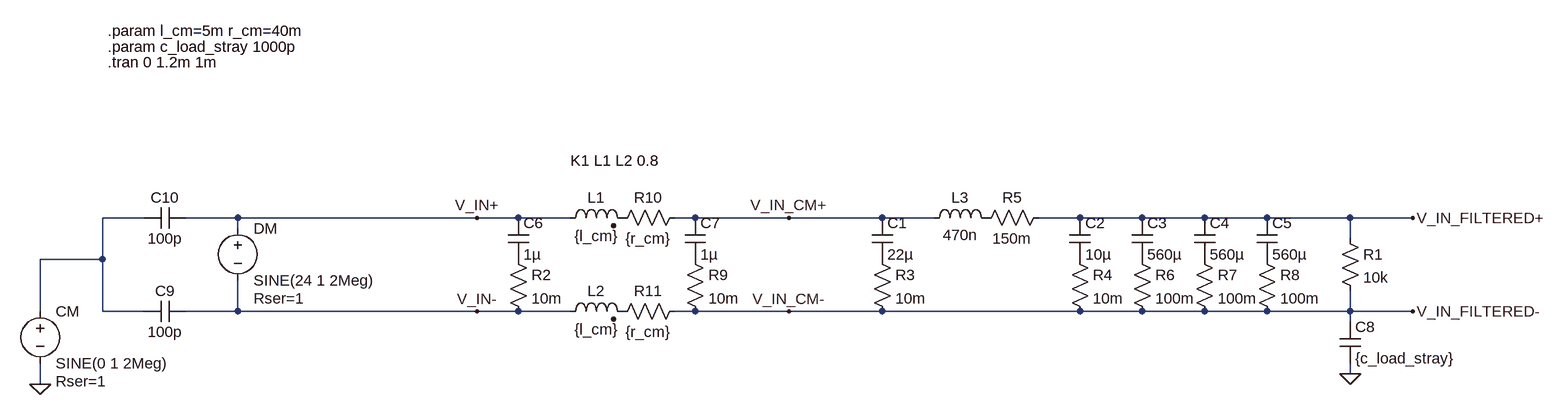
[diagram p0: schematic EMI_FILTER.asc]
EMI_FILTER.asc, the LTspice schematic file:
Version 4.1
SHEET 1 2384 752
WIRE -16 128 -80 128
WIRE 128 128 48 128
WIRE 496 128 128 128
WIRE 560 128 496 128
WIRE 640 128 560 128
WIRE 832 128 800 128
WIRE 976 128 832 128
WIRE 1120 128 976 128
WIRE 1200 128 1120 128
WIRE 1424 128 1360 128
WIRE 1520 128 1424 128
WIRE 1616 128 1520 128
WIRE 1712 128 1616 128
WIRE 1840 128 1712 128
WIRE 1936 128 1840 128
WIRE 128 144 128 128
WIRE 1840 160 1840 128
WIRE -80 192 -80 128
WIRE -80 192 -176 192
WIRE -176 272 -176 192
WIRE -80 272 -80 192
WIRE -16 272 -80 272
WIRE 128 272 128 224
WIRE 128 272 48 272
WIRE 496 272 128 272
WIRE 560 272 496 272
WIRE 640 272 560 272
WIRE 832 272 800 272
WIRE 976 272 832 272
WIRE 1120 272 976 272
WIRE 1424 272 1120 272
WIRE 1520 272 1424 272
WIRE 1616 272 1520 272
WIRE 1712 272 1616 272
WIRE 1840 272 1840 240
WIRE 1840 272 1712 272
WIRE 1936 272 1840 272
WIRE 1840 288 1840 272
WIRE 1840 368 1840 352
WIRE -176 384 -176 352
FLAG 976 128 V_IN_CM+
FLAG 976 272 V_IN_CM-
FLAG 1840 368 0
FLAG -176 384 0
FLAG 1936 128 V_IN_FILTERED+
FLAG 1936 272 V_IN_FILTERED-
FLAG 496 128 V_IN+
FLAG 496 272 V_IN-
SYMBOL cap 1104 128 R0
SYMATTR InstName C1
SYMATTR Value 22µ
SYMBOL ind 1184 144 R270
WINDOW 0 32 56 VTop 2
WINDOW 3 5 56 VBottom 2
SYMATTR InstName L3
SYMATTR Value 470n
SYMBOL cap 1408 128 R0
SYMATTR InstName C2
SYMATTR Value 10µ
SYMBOL res 1104 176 R0
SYMATTR InstName R3
SYMATTR Value 10m
SYMBOL res 1408 176 R0
SYMATTR InstName R4
SYMATTR Value 10m
SYMBOL res 1376 112 R90
WINDOW 0 0 56 VBottom 2
WINDOW 3 32 56 VTop 2
SYMATTR InstName R5
SYMATTR Value 150m
SYMBOL cap 1504 128 R0
SYMATTR InstName C3
SYMATTR Value 560µ
SYMBOL res 1504 176 R0
SYMATTR InstName R6
SYMATTR Value 100m
SYMBOL cap 1600 128 R0
SYMATTR InstName C4
SYMATTR Value 560µ
SYMBOL res 1600 176 R0
SYMATTR InstName R7
SYMATTR Value 100m
SYMBOL cap 1696 128 R0
SYMATTR InstName C5
SYMATTR Value 560µ
SYMBOL res 1696 176 R0
SYMATTR InstName R8
SYMATTR Value 100m
SYMBOL res 1824 144 R0
SYMATTR InstName R1
SYMATTR Value 10k
SYMBOL cap 544 128 R0
SYMATTR InstName C6
SYMATTR Value 1µ
SYMBOL res 544 176 R0
SYMATTR InstName R2
SYMATTR Value 10m
SYMBOL cap 816 128 R0
SYMATTR InstName C7
SYMATTR Value 1µ
SYMBOL res 816 176 R0
SYMATTR InstName R9
SYMATTR Value 10m
SYMBOL ind2 624 144 R270
WINDOW 0 32 56 VTop 2
WINDOW 3 4 56 VBottom 2
SYMATTR InstName L1
SYMATTR Value {l_cm}
SYMBOL res 816 112 R90
WINDOW 0 0 56 VBottom 2
WINDOW 3 32 56 VTop 2
SYMATTR InstName R10
SYMATTR Value {r_cm}
SYMBOL ind2 624 288 R270
WINDOW 0 32 56 VTop 2
WINDOW 3 4 56 VBottom 2
SYMATTR InstName L2
SYMATTR Value {l_cm}
SYMBOL res 816 256 R90
WINDOW 0 0 56 VBottom 2
WINDOW 3 32 56 VTop 2
SYMATTR InstName R11
SYMATTR Value {r_cm}
SYMBOL cap 1824 288 R0
SYMATTR InstName C8
SYMATTR Value {c_load_stray}
SYMBOL voltage 128 128 R0
WINDOW 123 0 0 Left 0
WINDOW 39 24 124 Left 2
SYMATTR SpiceLine Rser=1
SYMATTR InstName DM
SYMATTR Value SINE(24 1 2Meg)
SYMBOL cap 48 256 R90
WINDOW 0 0 32 VBottom 2
WINDOW 3 32 32 VTop 2
SYMATTR InstName C9
SYMATTR Value 100p
SYMBOL cap 48 112 R90
WINDOW 0 0 32 VBottom 2
WINDOW 3 32 32 VTop 2
SYMATTR InstName C10
SYMATTR Value 100p
SYMBOL voltage -176 256 R0
WINDOW 123 0 0 Left 0
WINDOW 39 24 124 Left 2
SYMATTR SpiceLine Rser=1
SYMATTR InstName CM
SYMATTR Value SINE(0 1 2Meg)
TEXT 640 40 Left 2 !K1 L1 L2 0.8
TEXT -72 -136 Left 2 !.param c_load_stray 1000p
TEXT -72 -112 Left 2 !.tran 0 1.2m 1m
TEXT -72 -160 Left 2 !.param l_cm=5m r_cm=40m

The netlist it stands for:
* EMI_FILTER.asc
C1 V_IN_CM+ P001 22µ
L3 V_IN_CM+ P002 470n
C2 V_IN_FILTERED+ P003 10µ
R3 P001 V_IN_FILTERED- 10m
R4 P003 V_IN_FILTERED- 10m
R5 V_IN_FILTERED+ P002 150m
C3 V_IN_FILTERED+ P004 560µ
R6 P004 V_IN_FILTERED- 100m
C4 V_IN_FILTERED+ P005 560µ
R7 P005 V_IN_FILTERED- 100m
C5 V_IN_FILTERED+ P006 560µ
R8 P006 V_IN_FILTERED- 100m
R1 V_IN_FILTERED+ V_IN_FILTERED- 10k
C6 V_IN+ P007 1µ
R2 P007 V_IN- 10m
C7 V_IN_CM+ P008 1µ
R9 P008 V_IN_FILTERED- 10m
L1 V_IN+ P009 {l_cm}
R10 V_IN_CM+ P009 {r_cm}
L2 V_IN- P010 {l_cm}
R11 V_IN_FILTERED- P010 {r_cm}
C8 V_IN_FILTERED- 0 {c_load_stray}
V§DM V_IN+ V_IN- SINE(24 1 2Meg) Rser=1
C9 V_IN- N001 100p
C10 V_IN+ N001 100p
V§CM N001 0 SINE(0 1 2Meg) Rser=1
K1 L1 L2 0.8
.param c_load_stray 1000p
.tran 0 1.2m 1m
.param l_cm=5m r_cm=40m
.backanno
.end